# Altium schematic sheet cpu.SchDoc
size B
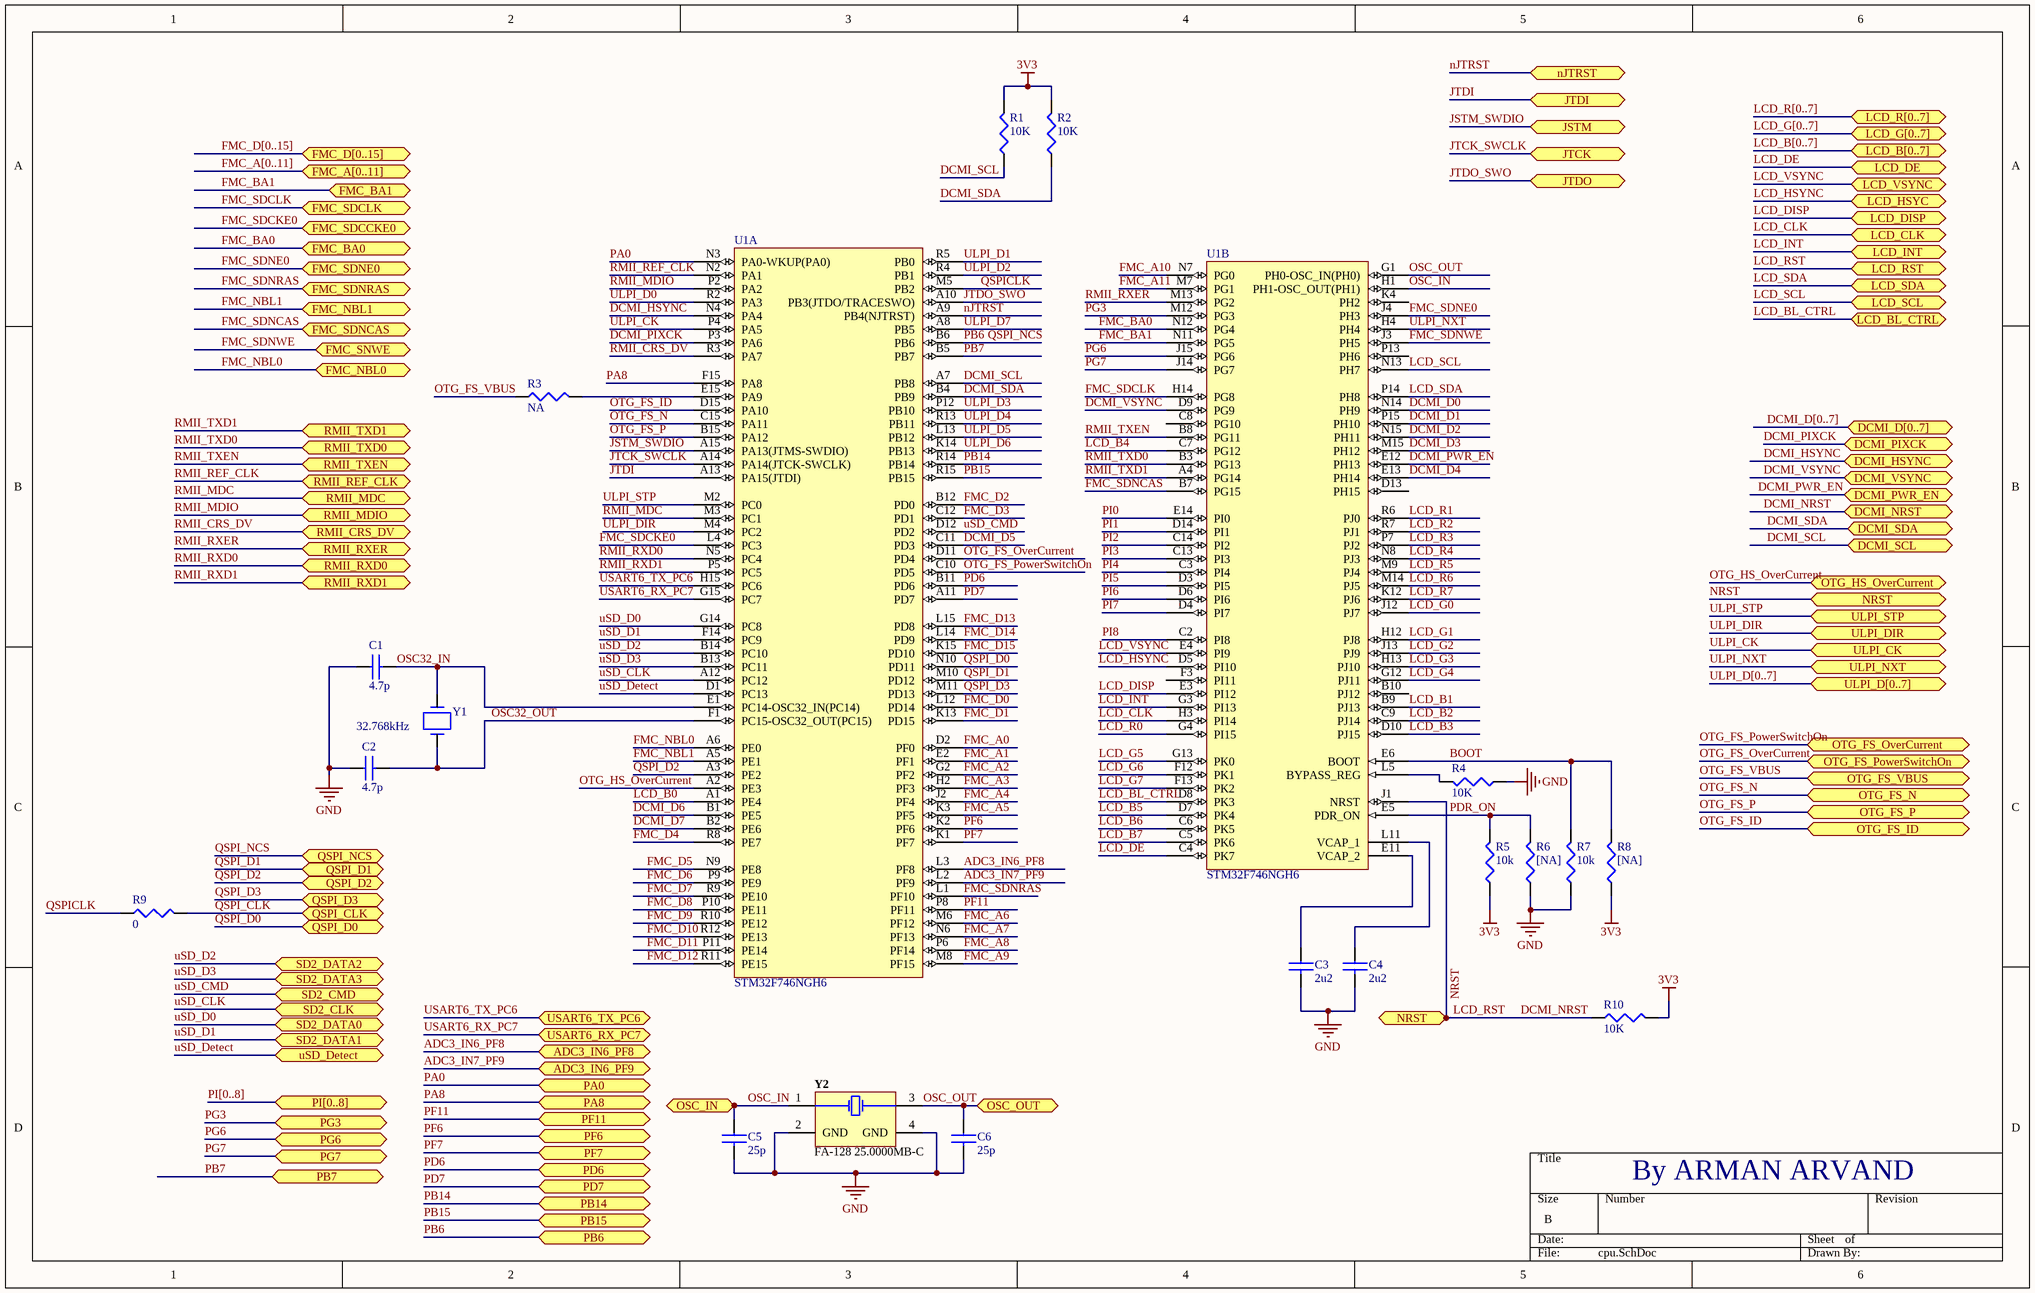
[diagram p0: cpu.SchDoc]

## Parts
C1  4.7p  [C0402]
C2  4.7p  [C0402]
C3  2u2  [C0402]
C4  2u2  [C0402]
C5  25p  [C0402]
C6  25p  [C0402]
R1  10K  [R0402]
R2  10K  [R0402]
R3  NA  [R0402]
R4  10K  [R0402]
R5  10k  [R0402]
R6  [NA]  [R0402]
R7  10k  [R0402]
R8  [NA]  [R0402]
R9  0  [R0402]
R10  10K  [R0402]
U1  STM32F746NGH6  [STM-TFBGA216]  (parts A,B of 3)
Y1  32.768kHz  [ABS06]
Y2  FA-128 25.0000MB-C  [EPSON-FA-128_V]

## Ports
ADC3_IN6_PF8 (bidir), ADC3_IN6_PF9 (bidir), DCMI_D[0..7] (bidir), DCMI_HSYNC (bidir), DCMI_NRST (bidir), DCMI_PIXCK (bidir), DCMI_PWR_EN (bidir), DCMI_SCL (bidir), DCMI_SDA (bidir), DCMI_VSYNC (bidir), FMC_A[0..11] (bidir), FMC_BA0 (bidir), FMC_BA1 (bidir), FMC_D[0..15] (bidir), FMC_NBL0 (bidir), FMC_NBL1 (bidir), FMC_SDCCKE0 (bidir), FMC_SDCLK (bidir), FMC_SDNCAS (bidir), FMC_SDNE0 (bidir), FMC_SDNRAS (bidir), FMC_SNWE (bidir), JSTM (bidir), JTCK (bidir), JTDI (bidir), JTDO (bidir), LCD_B[0..7] (bidir), LCD_BL_CTRL (bidir), LCD_CLK (bidir), LCD_DE (bidir), LCD_DISP (bidir), LCD_G[0..7] (bidir), LCD_HSYC (bidir), LCD_INT (bidir), LCD_R[0..7] (bidir), LCD_RST (bidir), LCD_SCL (bidir), LCD_SDA (bidir), LCD_VSYNC (bidir), nJTRST (bidir), NRST (bidir), OSC_IN (bidir), OSC_OUT (bidir), OTG_FS_ID (bidir), OTG_FS_N (bidir), OTG_FS_OverCurrent (bidir), OTG_FS_P (bidir), OTG_FS_PowerSwitchOn (bidir), OTG_FS_VBUS (bidir), OTG_HS_OverCurrent (bidir), PA0 (bidir), PA8 (bidir), PB6 (bidir), PB7 (bidir), PB14 (bidir), PB15 (bidir), PD6 (bidir), PD7 (bidir), PF6 (bidir), PF7 (bidir), PF11 (bidir), PG3 (bidir), PG6 (bidir), PG7 (bidir), PI[0..8] (bidir), QSPI_CLK (bidir), QSPI_D0 (bidir), QSPI_D1 (bidir), QSPI_D2 (bidir), QSPI_D3 (bidir), QSPI_NCS (bidir), RMII_CRS_DV (bidir), RMII_MDC (bidir), RMII_MDIO (bidir), RMII_REF_CLK (bidir), RMII_RXD0 (bidir), RMII_RXD1 (bidir), RMII_RXER (bidir), RMII_TXD0 (bidir), RMII_TXD1 (bidir), RMII_TXEN (bidir), SD2_CLK (bidir), SD2_CMD (bidir), SD2_DATA0 (bidir), SD2_DATA1 (bidir), SD2_DATA2 (bidir), SD2_DATA3 (bidir), ULPI_CK (bidir), ULPI_D[0..7] (bidir), ULPI_DIR (bidir), ULPI_NXT (bidir), ULPI_STP (bidir), USART6_RX_PC7 (bidir), USART6_TX_PC6 (bidir), uSD_Detect (bidir)

## Nets
3V3: R1.2 R2.2 R5.1 R8.1 R10.2
GND: C1.1 C2.1 C3.2 C4.2 C5.2 C6.2 R4.1 R6.1 R7.1 Y2.2(GND) Y2.4(GND)
ADC3_IN6_PF8: U1.L3(PF8) ; port ADC3_IN6_PF8
ADC3_IN7_PF9: U1.L2(PF9) ; port ADC3_IN6_PF9
BOOT: R7.2 R8.2 U1.E6(BOOT)
DCMI_D0: U1.N14(PH9)
DCMI_D1: U1.P15(PH10)
DCMI_D2: U1.N15(PH11)
DCMI_D3: U1.M15(PH12)
DCMI_D4: U1.E13(PH14)
DCMI_D5: U1.C11(PD3)
DCMI_D6: U1.B1(PE5)
DCMI_D7: U1.B2(PE6)
DCMI_HSYNC: U1.N4(PA4) ; port DCMI_HSYNC
DCMI_NRST: R10.1 U1.J1(NRST) ; port LCD_RST, port DCMI_NRST, port NRST  [also labelled LCD_RST, NRST]
DCMI_PIXCK: U1.P3(PA6) ; port DCMI_PIXCK
DCMI_PWR_EN: U1.E12(PH13) ; port DCMI_PWR_EN
DCMI_SCL: R1.1 U1.A7(PB8) ; port DCMI_SCL
DCMI_SDA: R2.1 U1.B4(PB9) ; port DCMI_SDA
DCMI_VSYNC: U1.D9(PG9) ; port DCMI_VSYNC
FMC_A0: U1.D2(PF0)
FMC_A1: U1.E2(PF1)
FMC_A2: U1.G2(PF2)
FMC_A3: U1.H2(PF3)
FMC_A4: U1.J2(PF4)
FMC_A5: U1.K3(PF5)
FMC_A6: U1.M6(PF12)
FMC_A7: U1.N6(PF13)
FMC_A8: U1.P6(PF14)
FMC_A9: U1.M8(PF15)
FMC_A10: U1.N7(PG0)
FMC_A11: U1.M7(PG1)
FMC_BA0: U1.N12(PG4) ; port FMC_BA0
FMC_BA1: U1.N11(PG5) ; port FMC_BA1
FMC_D0: U1.L12(PD14)
FMC_D1: U1.K13(PD15)
FMC_D2: U1.B12(PD0)
FMC_D3: U1.C12(PD1)
FMC_D4: U1.R8(PE7)
FMC_D5: U1.N9(PE8)
FMC_D6: U1.P9(PE9)
FMC_D7: U1.R9(PE10)
FMC_D8: U1.P10(PE11)
FMC_D9: U1.R10(PE12)
FMC_D10: U1.R12(PE13)
FMC_D11: U1.P11(PE14)
FMC_D12: U1.R11(PE15)
FMC_D13: U1.L15(PD8)
FMC_D14: U1.L14(PD9)
FMC_D15: U1.K15(PD10)
FMC_NBL0: U1.A6(PE0) ; port FMC_NBL0
FMC_NBL1: U1.A5(PE1) ; port FMC_NBL1
FMC_SDCKE0: U1.L4(PC3) ; port FMC_SDCCKE0
FMC_SDCLK: U1.H14(PG8) ; port FMC_SDCLK
FMC_SDNCAS: U1.B7(PG15) ; port FMC_SDNCAS
FMC_SDNE0: U1.J4(PH3) ; port FMC_SDNE0
FMC_SDNRAS: U1.L1(PF10) ; port FMC_SDNRAS
FMC_SDNWE: U1.J3(PH5) ; port FMC_SNWE
JSTM_SWDIO: U1.A15(PA13(JTMS-SWDIO)) ; port JSTM
JTCK_SWCLK: U1.A14(PA14(JTCK-SWCLK)) ; port JTCK
JTDI: U1.A13(PA15(JTDI)) ; port JTDI
JTDO_SWO: U1.A10(PB3(JTDO/TRACESWO)) ; port JTDO
LCD_B0: U1.A1(PE4)
LCD_B1: U1.B9(PJ13)
LCD_B2: U1.C9(PJ14)
LCD_B3: U1.D10(PJ15)
LCD_B4: U1.C7(PG12)
LCD_B5: U1.D7(PK4)
LCD_B6: U1.C6(PK5)
LCD_B7: U1.C5(PK6)
LCD_BL_CTRL: U1.D8(PK3) ; port LCD_BL_CTRL
LCD_CLK: U1.H3(PI14) ; port LCD_CLK
LCD_DE: U1.C4(PK7) ; port LCD_DE
LCD_DISP: U1.E3(PI12) ; port LCD_DISP
LCD_G0: U1.J12(PJ7)
LCD_G1: U1.H12(PJ8)
LCD_G2: U1.J13(PJ9)
LCD_G3: U1.H13(PJ10)
LCD_G4: U1.G12(PJ11)
LCD_G5: U1.G13(PK0)
LCD_G6: U1.F12(PK1)
LCD_G7: U1.F13(PK2)
LCD_HSYNC: U1.D5(PI10) ; port LCD_HSYC
LCD_INT: U1.G3(PI13) ; port LCD_INT
LCD_R0: U1.G4(PI15)
LCD_R1: U1.R6(PJ0)
LCD_R2: U1.R7(PJ1)
LCD_R3: U1.P7(PJ2)
LCD_R4: U1.N8(PJ3)
LCD_R5: U1.M9(PJ4)
LCD_R6: U1.M14(PJ5)
LCD_R7: U1.K12(PJ6)
LCD_SCL: U1.N13(PH7) ; port LCD_SCL
LCD_SDA: U1.P14(PH8) ; port LCD_SDA
LCD_VSYNC: U1.E4(PI9) ; port LCD_VSYNC
nJTRST: U1.A9(PB4(NJTRST)) ; port nJTRST
OSC32_IN: C1.2 U1.E1(PC14-OSC32_IN(PC14)) Y1.2
OSC32_OUT: C2.2 U1.F1(PC15-OSC32_OUT(PC15)) Y1.1
OSC_IN: C5.1 U1.H1(PH1-OSC_OUT(PH1)) Y2.1(X1) ; port OSC_IN
OSC_OUT: C6.1 U1.G1(PH0-OSC_IN(PH0)) Y2.3(X2) ; port OSC_OUT
OTG_FS_ID: U1.D15(PA10) ; port OTG_FS_ID
OTG_FS_N: U1.C15(PA11) ; port OTG_FS_N
OTG_FS_OverCurrent: U1.D11(PD4) ; port OTG_FS_PowerSwitchOn
OTG_FS_P: U1.B15(PA12) ; port OTG_FS_P
OTG_FS_PowerSwitchOn: U1.C10(PD5) ; port OTG_FS_OverCurrent
OTG_FS_VBUS: R3.1 ; port OTG_FS_VBUS
OTG_HS_OverCurrent: U1.A2(PE3) ; port OTG_HS_OverCurrent
PA0: U1.N3(PA0-WKUP(PA0)) ; port PA0
PA8: U1.F15(PA8) ; port PA8
PB6: U1.B6(PB6) ; port QSPI_NCS, port PB6  [also labelled QSPI_NCS]
PB7: U1.B5(PB7) ; port PB7
PB14: U1.R14(PB14) ; port PB14
PB15: U1.R15(PB15) ; port PB15
PD6: U1.B11(PD6) ; port PD6
PD7: U1.A11(PD7) ; port PD7
PDR_ON: R5.2 R6.2 U1.E5(PDR_ON)
PF6: U1.K2(PF6) ; port PF6
PF7: U1.K1(PF7) ; port PF7
PF11: U1.P8(PF11) ; port PF11
PG3: U1.M12(PG3) ; port PG3
PG6: U1.J15(PG6) ; port PG6
PG7: U1.J14(PG7) ; port PG7
PI0: U1.E14(PI0)
PI1: U1.D14(PI1)
PI2: U1.C14(PI2)
PI3: U1.C13(PI3)
PI4: U1.C3(PI4)
PI5: U1.D3(PI5)
PI6: U1.D6(PI6)
PI7: U1.D4(PI7)
PI8: U1.C2(PI8)
QSPI_CLK: R9.2 ; port QSPI_CLK
QSPI_D0: U1.N10(PD11) ; port QSPI_D0
QSPI_D1: U1.M10(PD12) ; port QSPI_D1
QSPI_D2: U1.A3(PE2) ; port QSPI_D2
QSPI_D3: U1.M11(PD13) ; port QSPI_D3
QSPICLK: R9.1 U1.M5(PB2)
RMII_CRS_DV: U1.R3(PA7) ; port RMII_CRS_DV
RMII_MDC: U1.M3(PC1) ; port RMII_MDC
RMII_MDIO: U1.P2(PA2) ; port RMII_MDIO
RMII_REF_CLK: U1.N2(PA1) ; port RMII_REF_CLK
RMII_RXD0: U1.N5(PC4) ; port RMII_RXD0
RMII_RXD1: U1.P5(PC5) ; port RMII_RXD1
RMII_RXER: U1.M13(PG2) ; port RMII_RXER
RMII_TXD0: U1.B3(PG13) ; port RMII_TXD0
RMII_TXD1: U1.A4(PG14) ; port RMII_TXD1
RMII_TXEN: U1.B8(PG11) ; port RMII_TXEN
ULPI_CK: U1.P4(PA5) ; port ULPI_CK
ULPI_D0: U1.R2(PA3)
ULPI_D1: U1.R5(PB0)
ULPI_D2: U1.R4(PB1)
ULPI_D3: U1.P12(PB10)
ULPI_D4: U1.R13(PB11)
ULPI_D5: U1.L13(PB12)
ULPI_D6: U1.K14(PB13)
ULPI_D7: U1.A8(PB5)
ULPI_DIR: U1.M4(PC2) ; port ULPI_DIR
ULPI_NXT: U1.H4(PH4) ; port ULPI_NXT
ULPI_STP: U1.M2(PC0) ; port ULPI_STP
USART6_RX_PC7: U1.G15(PC7) ; port USART6_RX_PC7
USART6_TX_PC6: U1.H15(PC6) ; port USART6_TX_PC6
uSD_CLK: U1.A12(PC12) ; port SD2_CLK
uSD_CMD: U1.D12(PD2) ; port SD2_CMD
uSD_D0: U1.G14(PC8) ; port SD2_DATA0
uSD_D1: U1.F14(PC9) ; port SD2_DATA1
uSD_D2: U1.B14(PC10) ; port SD2_DATA2
uSD_D3: U1.B13(PC11) ; port SD2_DATA3
uSD_Detect: U1.D1(PC13) ; port uSD_Detect
NetC3_1: C3.1 U1.E11(VCAP_2)
NetC4_1: C4.1 U1.L11(VCAP_1)
NetR3_2: R3.2 U1.E15(PA9)
NetR4_2: R4.2 U1.L5(BYPASS_REG)

Not connected (* = marked no-connect by the designer): U1 B10(PJ12) C8(PG10) D13(PH15) F3(PI11) K4(PH2) P13(PH6)

## Buses and harness runs
bus DCMI_D[0..7] = port DCMI_D[0..7]
bus FMC_A[0..11] = port FMC_A[0..11]
bus FMC_D[0..15] = port FMC_D[0..15]
bus LCD_B[0..7] = port LCD_B[0..7]
bus LCD_G[0..7] = port LCD_G[0..7]
bus LCD_R[0..7] = port LCD_R[0..7]
bus PI[0..8] = port PI[0..8]
bus ULPI_D[0..7] = port ULPI_D[0..7]

## Notes on the sheet
- By ARMAN ARVAND

## Library data of the parts
C1 C2 C5 C6 = C1005C0G1H180J: CAP CER 18PF 50V C0G 5% 0402; Manufacturer: TDK Corporation; .Checked PCB: used; Temperature Coefficient: C0G, NP0; Capacitance: 18pF; Category: Capacitors; Supplier Part Number: 445-1238-1-ND; Manufacturer Part Number: C1005C0G1H180J; Operating Temperature: -55°C ~ 125°C; Package / Case: 0402 (1005 Metric); Price 1k [$]: 0.00468; Value: 18pF; .Checked SCH: used; Voltage - Rated: 50V; Supplier: Digikey; Supplier 1: Digi-Key; Supplier Part Number 1: 445-1238-1-ND; RoHS: RoHS Compliant; Stock 1: 24321; Pricing 1: 1=0.08, 10=0.05, 100=0.018, 250=0.013, 500=0.0096, 1000=0.0065 (USD); Tolerance: ±5%; Mounting Type: Surface Mount, MLCC; Applications: General Purpose; Ratings: -; Size / Dimension: 0.039" L x 0.020" W (1.00mm x 0.50mm); Height - Seated (Max): -; Thickness (Max): 0.022" (0.55mm); Lead Spacing: -; Features: -; Packaging: Cut Tape (CT); Lead Style: -; ComponentLink1URL: http://www.tdk.co.jp/tefe02/e412_c.pdf; ComponentLink1Description: http://www.tdk.co.jp/tefe02/e412_c.pdf
C3 C4 = C1005X5R1A225K: CAP CER 2.2UF 10V 10% X5R 0402; Manufacturer: TDK Corporation; Capacitance: 2.2µF; .Checked PCB: RF; Supplier 1: Digi-Key; Supplier Part Number 1: 445-7392-1-ND; Manufacturer Part Number: C1005X5R1A225K; RoHS: RoHS Compliant; Category: Capacitors; Stock 1: 22891; Pricing 1: 1=0.42, 10=0.332, 100=0.2, 250=0.15, 500=0.128, 1000=0.1 (USD); Voltage - Rated: 10V; Tolerance: ±10%; Temperature Coefficient: X5R; Mounting Type: Surface Mount, MLCC; Operating Temperature: -55°C ~ 85°C; Applications: General Purpose; Ratings: -; Package / Case: 0402 (1005 Metric); Size / Dimension: 0.039" L x 0.020" W (1.00mm x 0.50mm); Height - Seated (Max): -; Thickness (Max): 0.022" (0.55mm); Lead Spacing: -; Features: -; Packaging: Cut Tape (CT); Lead Style: -; ComponentLink1URL: http://www.tdk.com/pdf/general_B11.pdf; ComponentLink1Description: http://www.tdk.com/pdf/general_B11.pdf; .Checked SCH: RF
R1-R4 R9 R10 = RC0402FR-07100RL: RES 100 OHM 1/16W 1% 0402 SMD; Manufacturer: Yageo; Resistance (Ohms): 100; Power (Watts): 0.063W, 1/16W; Value: 100R; .Checked PCB: RF; Temperature Coefficient: ±100ppm/°C; Category: Resistors; Supplier Part Number: 311-100LRCT-ND; Manufacturer Part Number: RC0402FR-07100RL; Package / Case: 0402 (1005 Metric); Price 1k [$]: 0.01421; Tolerance: ±1%; .Checked SCH: RF; Supplier: Digikey; Supplier 1: Digi-Key; Supplier Part Number 1: 311-100LRCT-ND; RoHS: RoHS Compliant; Stock 1: 1682040; Pricing 1: 10=0.014, 50=0.0104, 100=0.0079, 250=0.00584, 500=0.00432, 1000=0.00288 (USD); Composition: Thick Film; Features: -; Size / Dimension: 0.039" L x 0.020" W (1.00mm x 0.50mm); Height: 0.016" (0.40mm); Number of Terminations: 2; Packaging: Cut Tape (CT); ComponentLink1URL: http://www.yageo.com/documents/recent/PYu-RC0402_51_RoHS_L_6.pdf; ComponentLink1Description: http://www.yageo.com/documents/recent/PYu-RC0402_51_RoHS_L_6.pdf
R5 R7 = RC0402FR-0710KL: RES 10.0K OHM 1/16W 1% 0402 SMD; Manufacturer: Yageo; Power (Watts): 0.063W, 1/16W; .Checked PCB: used; Temperature Coefficient: ±100ppm/°C; Category: Resistors; Supplier Part Number: 311-10.0KLRCT-ND; Manufacturer Part Number: RC0402FR-0710KL; Package / Case: 0402 (1005 Metric); Price 1k [$]: 0.01421; Resistance (Ohms): 10K; Tolerance: ±1%; Value: 10k; .Checked SCH: used; Supplier: Digikey; Supplier 1: Digi-Key; Supplier Part Number 1: 311-10.0KLRCT-ND; RoHS: RoHS Compliant; Stock 1: 2916495; Pricing 1: 10=0.014, 50=0.0104, 100=0.0079, 250=0.00584, 500=0.00432, 1000=0.00288 (USD); Composition: Thick Film; Features: -; Size / Dimension: 0.039" L x 0.020" W (1.00mm x 0.50mm); Height: 0.016" (0.40mm); Number of Terminations: 2; Packaging: Cut Tape (CT); ComponentLink1URL: http://www.yageo.com/documents/recent/PYu-RC0402_51_RoHS_L_6.pdf; ComponentLink1Description: http://www.yageo.com/documents/recent/PYu-RC0402_51_RoHS_L_6.pdf
R6 R8 = RC0402FR-0710KL: RES 10.0K OHM 1/16W 1% 0402 SMD; Manufacturer: Yageo; Resistance (Ohms): 10K; Power (Watts): 0.063W, 1/16W; Value: 10k; .Checked PCB: used; Temperature Coefficient: ±100ppm/°C; Category: Resistors; Supplier Part Number: 311-10.0KLRCT-ND; Manufacturer Part Number: RC0402FR-0710KL; Package / Case: 0402 (1005 Metric); Price 1k [$]: 0.01421; Tolerance: ±1%; .Checked SCH: used; Supplier: Digikey; Supplier 1: Digi-Key; Supplier Part Number 1: 311-10.0KLRCT-ND; RoHS: RoHS Compliant; Stock 1: 2916495; Pricing 1: 10=0.014, 50=0.0104, 100=0.0079, 250=0.00584, 500=0.00432, 1000=0.00288 (USD); Composition: Thick Film; Features: -; Size / Dimension: 0.039" L x 0.020" W (1.00mm x 0.50mm); Height: 0.016" (0.40mm); Number of Terminations: 2; Packaging: Cut Tape (CT); ComponentLink1URL: http://www.yageo.com/documents/recent/PYu-RC0402_51_RoHS_L_6.pdf; ComponentLink1Description: http://www.yageo.com/documents/recent/PYu-RC0402_51_RoHS_L_6.pdf
U1 = STM32F746NGH6: ARM-Based Cortex-M7 32 Bit MCU+FPU, 462 DMIPS, 1024 kB Flash, 320 kB RAM, 168 I/Os, -40 to 85 degC, 216-Pin TFBGA, Halogen-Free, Tray; L1 Cache Data Memory: 4 KByte; Program Memory Size: 1024 KByte; Supply Voltage Max: 3.6 V; Clock Frequency Max: 216 MHz; Supply Voltage Min: 1.7 V; Number of I/Os: 168; Data RAM Size: 320 KByte; Data Bus Width: 32 bit; Temperature Min: -40 degC; L1 Cache Instruction Memory: 4 KByte; PartNumber: STM32F746NG; ComponentLink1Description: Manufacturer URL; ComponentLink2Description: Datasheet; DatasheetVersion: Rev. 1; ComponentLink3URL: http://www.st.com/st-web-ui/static/active/en/resource/technical/document/data_brief/DM00053488.pdf; ComponentLink1URL: http://www.st.com/web/en/home.html; Packing: Tray; ComponentLink2URL: http://www.st.com/st-web-ui/static/active/en/resource/technical/document/datasheet/DM00166116.pdf; ComponentLink3Description: Package Specification; PackageVersion: Rev. 2, 05/2013; Mounting Technology: Surface Mount; PackageDescription: 216-Ball Ultra Thin Fine Pitch Ball Grid Array, 13 x 13 x 0.8 mm Body, 0.8 mm Pitch; Temperature Max: 85 degC
Y1 = ABS06-32.768KHZ-9-1-T: CRYSTAL 32.768 KHZ 9.0 PF SMD; Manufacturer: Abracon Corporation; .Checked PCB: used; Frequency Stability: ±10ppm; Load Capacitance: 9pF; Operating Mode: Fundamental; .Checked SCH: used; Category: Crystals and Oscillators; Manufacturer Part Number: ABS06-32.768KHZ-9-1-T; Operating Temperature: -40°C ~ 85°C; Package / Case: 2-SMD, No Lead (DFN, LCC); Price 1k [$]: 1.24500; Value: 32.768kHz; Frequency: 32.768kHz; Supplier Part Number: 535-10247-1-ND; Supplier: Digikey; Supplier 1: Digi-Key; Supplier Part Number 1: 535-10247-1-ND; RoHS: RoHS Compliant; Stock 1: 5693; Pricing 1: 1=2.81, 10=2.438, 50=2.1376, 100=1.6875, 500=1.425 (USD); Type: kHz Crystal (Tuning Fork); Frequency Tolerance: ±10ppm; Mounting Type: Surface Mount; Size / Dimension: 0.079" L x 0.047" W (2.00mm x 1.20mm); Height: 0.024" (0.60mm); Packaging: Cut Tape (CT); ComponentLink1URL: http://www.abracon.com/Resonators/ABS06.pdf; ComponentLink1Description: http://www.abracon.com/Resonators/ABS06.pdf
Y2 = CMP-1695-00001-3: Range Crystal Unit, 25 MHz, -40 to 85 degC, 4-Pin SMD, RoHS, Tape and Reel; ComponentLink2Description: Datasheet; Mounting Technology: Surface Mount; PackageDescription: 4-Pin Surface Mount Device, Body 1.6 x 2 mm, Pitch 1.45 mm; ComponentLink1URL: https://www.eea.epson.com/; DatasheetVersion: Rev. Feb-15; ComponentLink2URL: https://support.epson.biz/td/api/doc_check.php?dl=brief_FA-128_en.pdf; ComponentLink1Description: Manufacturer URL; PartNumber: FA-128 25.0000MB-C